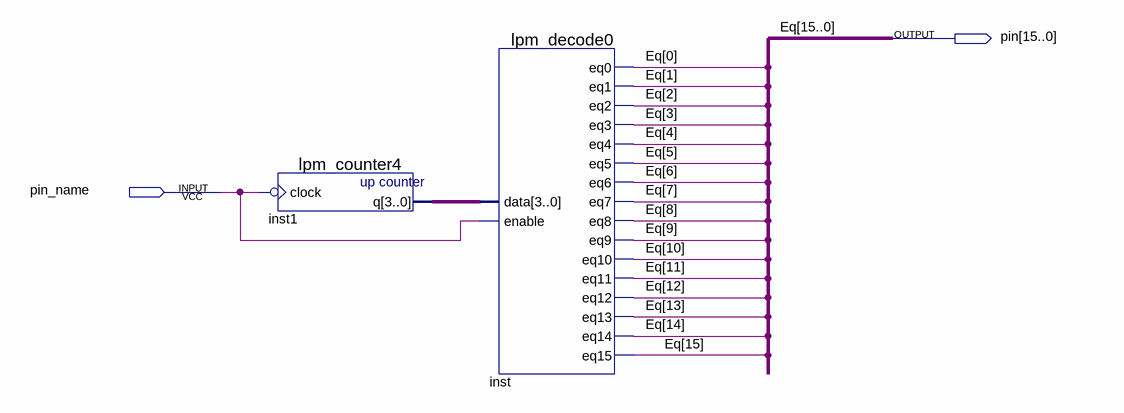
[diagram p0: schematic sheet]
// Quartus schematic Block3.bdf as structural Verilog: 2 symbols, 2 pins
module Block3 (
  input  pin_name,
  output [15:0] pin
);

  wire [3:0] inst1_q;

  lpm_counter4 inst1 (.clock(~pin_name), .q(inst1_q));
  lpm_decode0 inst (
    .data(inst1_q), .enable(pin_name), .eq0(pin[0]), .eq1(pin[1]), .eq2(pin[2]), .eq3(pin[3]), .eq4(pin[4]),
    .eq5(pin[5]), .eq6(pin[6]), .eq7(pin[7]), .eq8(pin[8]), .eq9(pin[9]), .eq10(pin[10]), .eq11(pin[11]),
    .eq12(pin[12]), .eq13(pin[13]), .eq14(pin[14]), .eq15(pin[15]));

  // Other names for the same wires on the sheet: Eq[15:0] = pin
endmodule
